# Altium schematic sheet CC Led Driver.SchDoc
size A; SheetNumber: 11; SheetTotal: 19
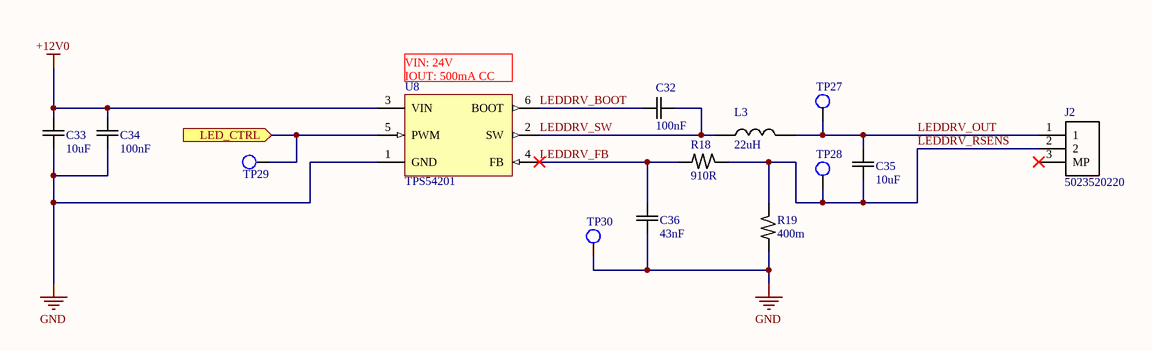
[diagram p0: CC Led Driver.SchDoc]

## Parts
C32  100nF  [C0603]
C33  10uF  [C1206]
C34  100nF  [C0603]
C35  10uF  [C1206]
C36  43nF  [C0603]
J2  5023520220  [5600200220]
L3  22uH  [Coil 9.7x9.2]
R18  910R  [R0603]
R19  400m  [R1206]
TP27  TestPoint  [TESTPOINT_SMD_1.27MM]  (value not drawn)  (no BOM)
TP28  TestPoint  [TESTPOINT_SMD_1.27MM]  (value not drawn)  (no BOM)
TP29  TestPoint  [TESTPOINT_SMD_1.27MM]  (value not drawn)  (no BOM)
TP30  TestPoint  [TESTPOINT_SMD_1.27MM]  (value not drawn)  (no BOM)
U8  TPS54201  [SOT23-6]

## Ports
LED_CTRL (in)

## Nets
+12V0: C33.2 C34.2 U8.3(VIN)
GND: C33.1 C34.1 C36.2 R19.1 TP30.1 U8.1(GND)
LED_CTRL: TP29.1 U8.5(PWM) ; port LED_CTRL
LEDDRV_BOOT: C32.2 U8.6(BOOT)
LEDDRV_FB: C36.1 R18.1 U8.4(FB)
LEDDRV_OUT: C35.1 J2.1 L3.2 TP27.1
LEDDRV_RSENS: C35.2 J2.2 R18.2 R19.2 TP28.1
LEDDRV_SW: C32.1 L3.1 U8.2(SW)

Not connected (* = marked no-connect by the designer): J2 3(MP)*

## Notes on the sheet
- (near U8) VIN: 24V
  IOUT: 500mA CC
- Project:
- Sheet Title:
- Size
- Date:
- A
- Sheet Number:
- Sheet Total:
- Revision:
- Time:
- Author:

## Library data of the parts
C32 C34 = Cap_cer: CAP CER 100nF 50V X7R 0603; MF: HRE; MP: CGA0603X7R104K500JT; ComponentLink1Description: Datasheet; ComponentLink1URL: https://www.lcsc.com/datasheet/C6119867.pdf; ComponentLink2Description: Supplier1; ComponentLink2URL: https://www.lcsc.com/product-detail/C6119867.html
C33 C35 = Cap_cer: CAP CER 10uF 25V X7R 1206; MF: SAMWHA; MP: CS3216X7R106K250NRI; ComponentLink1Description: Datasheet; ComponentLink1URL: https://www.lcsc.com/datasheet/C513767.pdf; ComponentLink2Description: Supplier1; ComponentLink2URL: https://www.lcsc.com/product-detail/C513767.html
C36 = Cap_cer: CAP CER 0.047UF 50V X7R 0603; MF: Yageo; MP: CC0603JRX7R9BB473; ComponentLink1Description: Datasheet; ComponentLink1URL: *; ComponentLink2Description: Supplier1; ComponentLink2URL: *
J2 = 5023520202: White 2P 1x2P Tin 2mm Copper Alloy 125V 2 3A 1 Surface Mount,Vertical SMD,P=2mm Headers, Male Pins ROHS; MF: MOLEX; MP: 5600200220; ComponentLink1Description: Supplier 1; ComponentLink1URL: https://www.lcsc.com/product-detail/C114092.html?s_z=n_5600200220; ComponentLink2Description: Datasheet; ComponentLink2URL: https://www.molex.com/content/dam/molex/molex-dot-com/products/automated/en-us/salesdrawingpdf/560/560020/5600200220_sd.pdf?inline\
L3 = Coil: FIXED IND 22uH 3A 130mΩ SMD,6.6x7.1mm; MF: YJYCOIN; MP: YSPI0630A-220M; ComponentLink1Description: Datasheet; ComponentLink1URL: https://www.lcsc.com/datasheet/C497873.pdf; ComponentLink2Description: Supplier1; ComponentLink2URL: https://www.lcsc.com/product-detail/C497873.html
R18 = Res: RES 910 OHM 1% 1/10W 0603; MF: Yageo; MP: RC0603FR-07910RL; ComponentLink1Description: Datasheet; ComponentLink1URL: *; ComponentLink2Description: Supplier1; ComponentLink2URL: *
R19 = Res: 400mΩ 1W ±100ppm/℃ Thin Film Resistor ±1% 1206 Chip Resistor - Surface Mount ROHS; MF: Milliohm; MP: HoJLRH1206-1W-400mR-1%; ComponentLink1Description: Datasheet; ComponentLink1URL: https://www.lcsc.com/datasheet/C46594300.pdf; ComponentLink2Description: Supplier1; ComponentLink2URL: https://www.lcsc.com/product-detail/C46594300.html
U8 = TPS54201: IC REG BUCK ADJ 1.5A TSOT23-6; MP: TPS54201DDCR; MF: Texas Instruments; ComponentLink1Description: Supplier 1; ComponentLink1URL: https://www.digikey.com/en/products/detail/texas-instruments/TPS54201DDCR/8133010; ComponentLink2Description: Datasheet; ComponentLink2URL: https://www.ti.com/lit/ds/symlink/tps54201.pdf